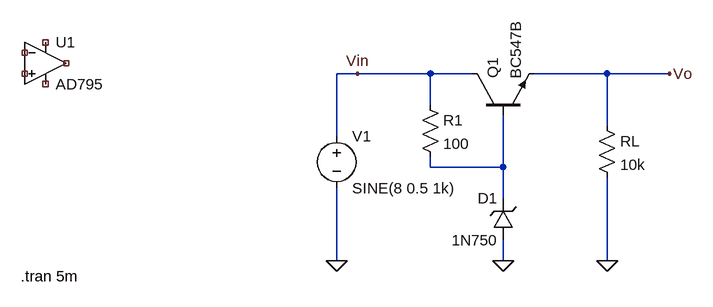
[diagram p0: schematic lab9.1.1.asc]
lab9.1.1.asc, the LTspice schematic file:
Version 4
SHEET 1 880 680
WIRE 208 112 176 112
WIRE 320 112 208 112
WIRE 384 112 320 112
WIRE 592 112 480 112
WIRE 688 112 592 112
WIRE 320 160 320 112
WIRE 592 192 592 112
WIRE 176 208 176 112
WIRE 320 256 320 240
WIRE 432 256 432 176
WIRE 432 256 320 256
WIRE 432 304 432 256
WIRE 176 400 176 288
WIRE 432 400 432 368
WIRE 592 400 592 272
FLAG 432 400 0
FLAG 688 112 Vo
FLAG 592 400 0
FLAG 208 112 Vin
FLAG 176 400 0
SYMBOL Opamps\\AD795 -272 32 R0
SYMATTR InstName U1
SYMBOL npn 384 176 R270
SYMATTR InstName Q1
SYMATTR Value BC547B
SYMBOL zener 448 368 R180
WINDOW 0 24 64 Left 2
WINDOW 3 24 0 Left 2
SYMATTR InstName D1
SYMATTR Value 1N750
SYMBOL res 304 144 R0
SYMATTR InstName R1
SYMATTR Value 100
SYMBOL res 576 176 R0
SYMATTR InstName RL
SYMATTR Value 10k
SYMBOL voltage 176 192 R0
WINDOW 123 0 0 Left 0
WINDOW 39 0 0 Left 0
SYMATTR InstName V1
SYMATTR Value SINE(8 0.5 1k)
TEXT -310 424 Left 2 !.tran 5m

The netlist it stands for:
* lab9.1.1.asc
XU1 NC_01 NC_02 NC_03 NC_04 NC_05 AD795  ; pins In+ In- V+ V- OUT
Q1 Vin N001 Vo 0 BC547B
D1 0 N001 1N750
R1 Vin N001 100
RL Vo 0 10k
V1 Vin 0 SINE(8 0.5 1k)
.model D D
.lib standard.dio
.model NPN NPN
.model PNP PNP
.lib standard.bjt
.tran 5m
.lib ADI1.lib
.backanno
.end